# EAGLE design ClipBoard (EAGLE 7.1.0)
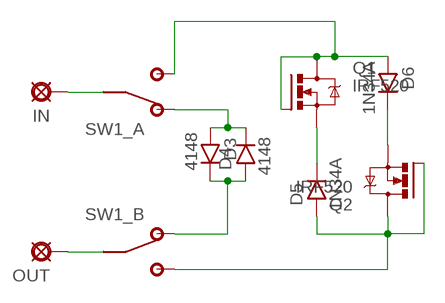
[diagram p0: schematic, sheet 1]

## Parts
D3  4148  1N4148-3  [DO35-3]
D4  4148  1N4148-3  [DO35-3]
D5  1N34A  DO07  [DO07]
D6  1N34A  DO07  [DO07]
IN  CLIPIN  PAD  [SQUARE]
OUT  CLIPOUT  PAD  [SQUARE]
Q1  IRF520  [TO220BV]
Q2  IRF520  [TO220BV]
SW1  DPDT  DPDTDPDT_2  [DPDT_PCB]

## Nets
N$1: D3.C D4.A SW1.B2
N$2: D5.C Q1.S
N$3: OUT.1(PAD) SW1.B1
N$4: D6.C Q2.S
N$5: D6.A Q1.D Q1.G SW1.A3
N$6: IN.1(PAD) SW1.A1
N$7: D3.A D4.C SW1.A2
N$8: D5.A Q2.D Q2.G SW1.B3

## Library data of the parts
D3 D4 = mb_diodes:1N4148: Fast Switching Diode DO-35 glass case a.k.a. 1N914
D5 D6 = mb_diodes:DO07: DO-07 Package for 1N34A and similar Ge diodes
IN OUT = mb_supply:PAD: PAD use this package for pads with any purpose, including input, output, send or return various pad shapes: round, square, octogonal, long, and long offset
Q1 Q2 = transistor-power:IRF520: HEXFET Power MOSFET
SW1 = mb_switches:DPDT

## Board
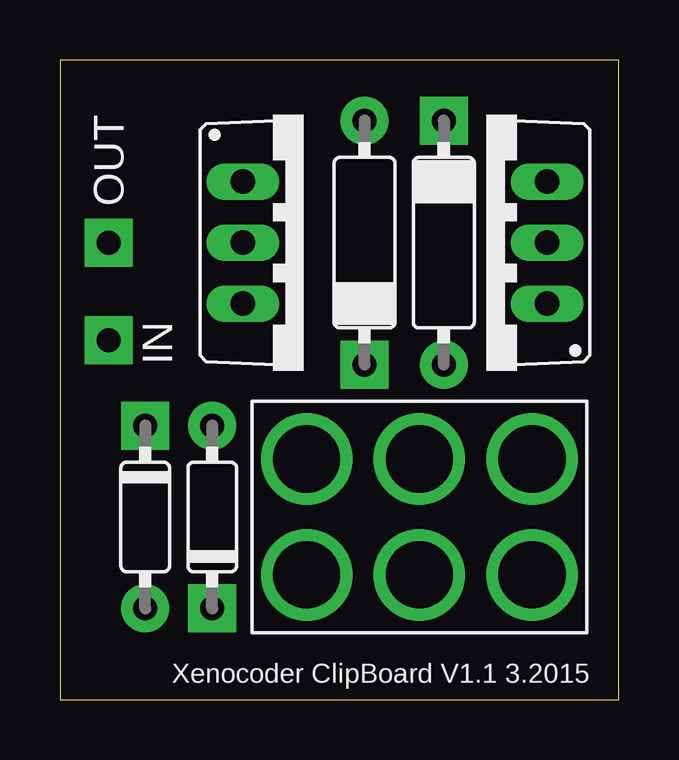
[diagram p1: board, top side]
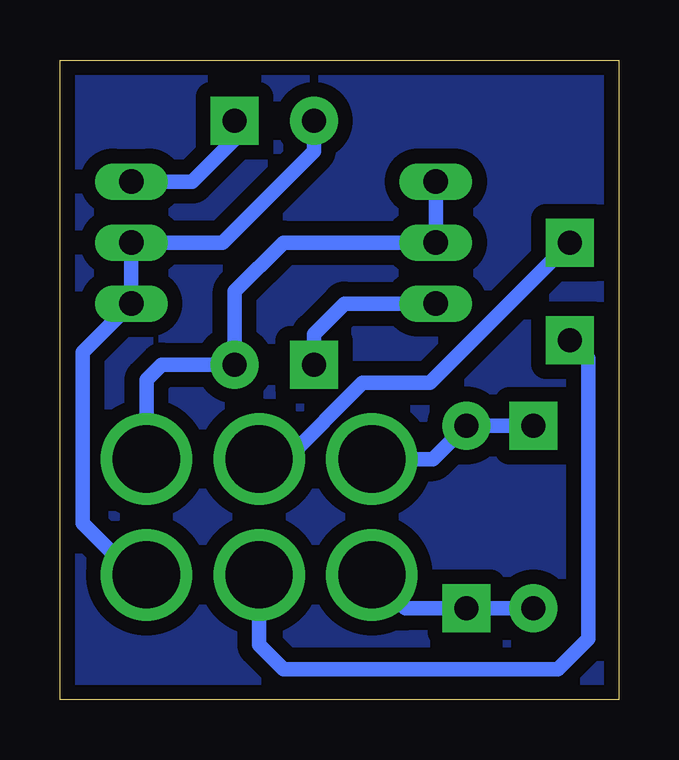
[diagram p2: board, bottom side, seen from below]

Size 23.29 x 26.66 mm. Coordinates in mm from the lower left corner, seen from the top.
Outline: 0,0 23.29,0 23.29,26.66 0,26.66 0,0
Copper layers (1*16): Top 0.0356mm / dielectric 1.5011mm / Bottom 0.0356mm
Design rules "LaenPCBOrder": minimum track width 6mil, minimum drill 13mil, track to track 6mil, track to pad 6mil, pad to pad 6mil, via to via 6mil, smd to smd 6mil, copper to edge 15mil, drill to drill 6mil, minimum pad ring 7mil, minimum via ring 7mil, stop-mask expansion 3mil, vias tented up to drill 0mil, thermal gap 10mil

### Footprints (pad centres in the part's own frame; a part is rotated, then mirrored left to right if it is on the bottom)
DO35-3 = drill 1 pad 2: A 3.81,0 | drill 1 pad 2 square: C -3.81,0
DO07 = drill 1 pad 2: A 5.08,0 | drill 1 pad 2 square: C -5.08,0
SQUARE = drill 1 pad 2 square: 1 0,0
TO220BV = drill 1.016 long: D 0,-2.54; G -2.54,-2.54; S 2.54,-2.54
DPDT_PCB = drill 2.8 pad 3.81: A1 -2.413,0; A2 -2.413,4.699; A3 -2.413,-4.699; B1 2.413,0; B2 2.413,4.699; B3 2.413,-4.699

### Placement (x,y rotation side)
D3  3.56,7.62 270 top
D4  6.35,7.62 90 top
D5  16,19.05 270 top
D6  12.7,19.05 90 top
IN  2.03,14.99 0 top
OUT  2.03,19.05 0 top
Q1  17.78,19.05 90 top
Q2  10.16,19.05 270 top
SW1  14.99,7.62 90 top

### Tracks (layer width: path | path; a pad name or v marks a point on that pad's centre or on a via)
GND
  pour Bottom (isolate 0.61): 0,26.67 23.62,26.67 23.62,0 0,0
N$1
  Bottom 0.61: D3.C D4.A 7.75,10.03 SW1.B2
N$2
  Bottom 0.61: D5.C 16,23.37 17.78,21.59 Q1.S
N$3
  Bottom 0.61: SW1.B1 13.84,10.03 10.67,13.21 7.87,13.21 OUT.1
N$4
  Bottom 0.61: D6.C 12.7,15.24 11.43,16.51 Q2.S
N$5
  Bottom 0.61: SW1.A3 20.19,5.21 22.35,7.37 22.35,14.48 Q1.G Q1.D 16.51,19.05 12.7,22.86 D6.A
N$6
  Bottom 0.61: SW1.A1 14.99,2.29 13.97,1.27 2.54,1.27 1.27,2.54 1.27,14.22 IN.1
N$7
  Bottom 0.61: D3.A D4.C 8.89,3.81 SW1.A2
N$8
  Bottom 0.61: Q2.G Q2.D 13.97,19.05 16,17.02 D5.A 19.05,13.97 19.68,13.34 SW1.B3

### Text on the board
tNames: Xenocoder ClipBoard V1.1 3.2015